# EAGLE schematic full_schema (EAGLE 9.6.2)
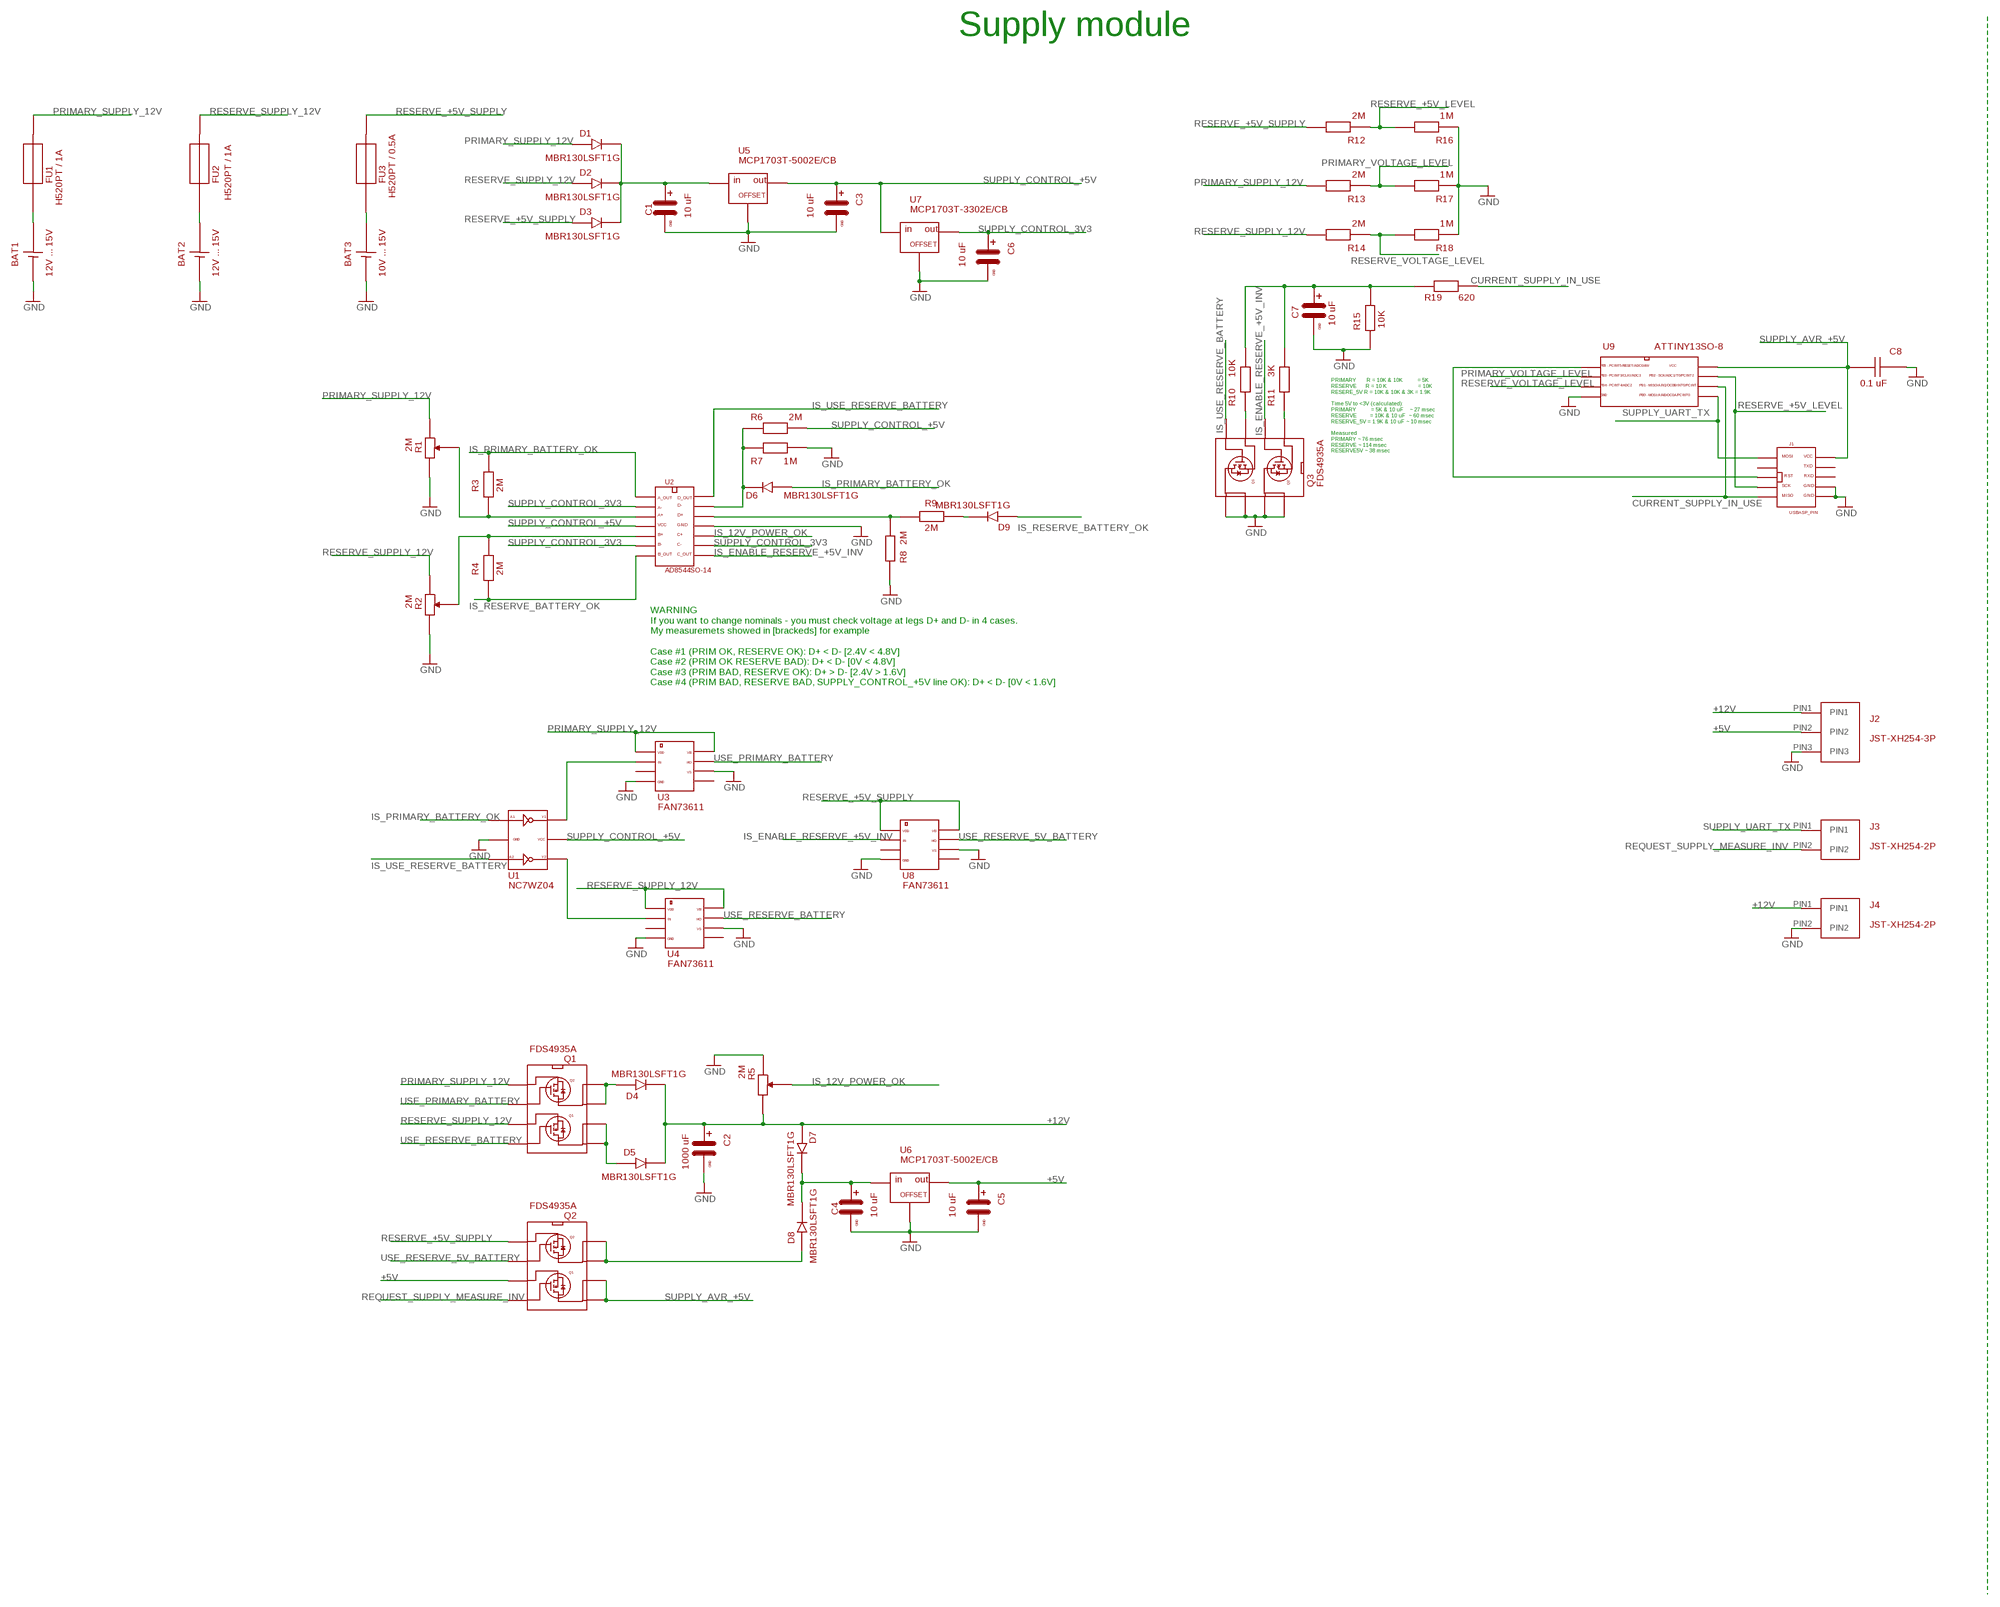
[diagram p0: schematic, sheet 1, part 1 of 2]
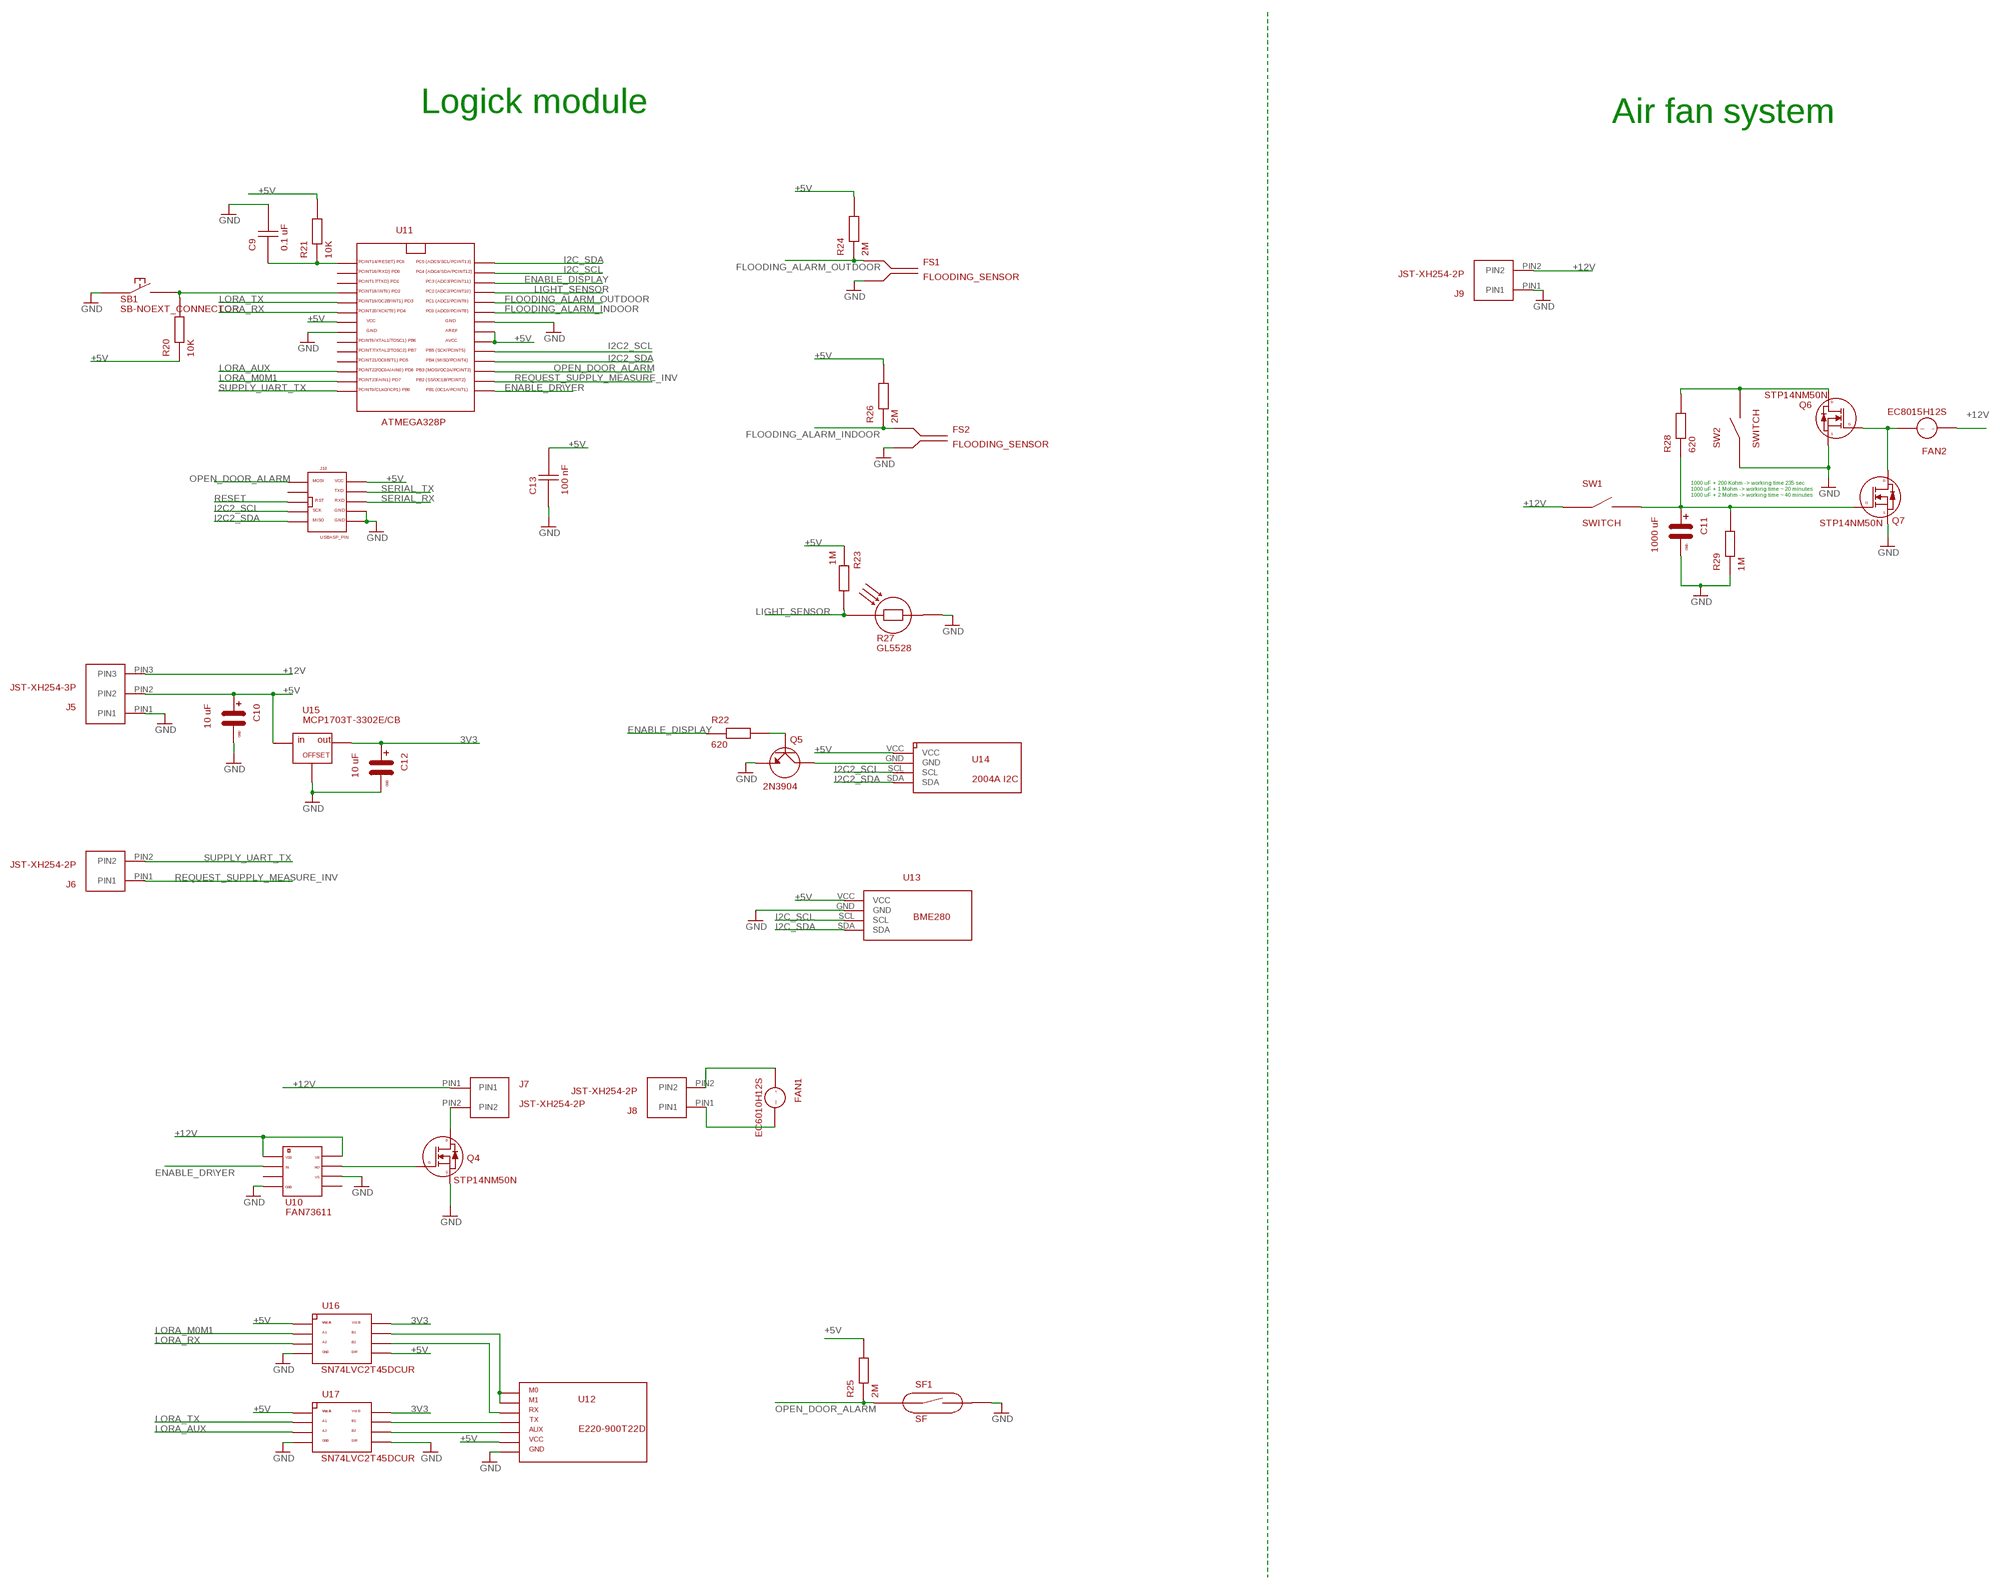
[diagram p1: schematic, sheet 1, part 2 of 2]

## Parts
BAT1  12V ... 15V  BATTERY  [BATTERY]
BAT2  12V ... 15V  BATTERY  [BATTERY]
BAT3  10V ... 15V  BATTERY  [BATTERY]
C1  10 uF  CMINI-5X7  [C-MINI-5X7]
C2  1000 uF  C  [C]
C3  10 uF  CMINI-5X7  [C-MINI-5X7]
C4  10 uF  CMINI-5X7  [C-MINI-5X7]
C5  10 uF  CMINI-5X7  [C-MINI-5X7]
C6  10 uF  CMINI-5X7  [C-MINI-5X7]
C7  10 uF  CMINI-5X7  [C-MINI-5X7]
C8  0.1 uF  C-1  [C-1]
C9  0.1 uF  C-1  [C-1]
C10  10 uF  CMINI-5X7  [C-MINI-5X7]
C11  1000 uF  C  [C]
C12  10 uF  CMINI-5X7  [C-MINI-5X7]
C13  100 nF  C-1  [C-1]
D1  MBR130LSFT1G  DSOD-123FL  [D-SOD-123FL]
D2  MBR130LSFT1G  DSOD-123FL  [D-SOD-123FL]
D3  MBR130LSFT1G  DSOD-123FL  [D-SOD-123FL]
D4  MBR130LSFT1G  DSOD-123FL  [D-SOD-123FL]
D5  MBR130LSFT1G  DSOD-123FL  [D-SOD-123FL]
D6  MBR130LSFT1G  DSOD-123FL  [D-SOD-123FL]
D7  MBR130LSFT1G  DSOD-123FL  [D-SOD-123FL]
D8  MBR130LSFT1G  DSOD-123FL  [D-SOD-123FL]
D9  MBR130LSFT1G  DSOD-123FL  [D-SOD-123FL]
FAN1  EC6010H12S  FAN_5V  [FAN_5V]
FAN2  EC8015H12S  FAN_5V  [FAN_5V]
FS1  FLOODING_SENSOR  [FLOODING_SENSOR]
FS2  FLOODING_SENSOR  [FLOODING_SENSOR]
FU1  H520PT / 1A  FU  [FU]
FU2  H520PT / 1A  FU  [FU]
FU3  H520PT / 0.5A  FU  [FU]
J1  USBASP_PIN  [USBASP_PIN]
J2  JST-XH254-3P  [JST-XH254-3P]
J3  JST-XH254-2P  [JST-XH254-2P]
J4  JST-XH254-2P  [JST-XH254-2P]
J5  JST-XH254-3P  [JST-XH254-3P]
J6  JST-XH254-2P  [JST-XH254-2P]
J7  JST-XH254-2P  [JST-XH254-2P]
J8  JST-XH254-2P  [JST-XH254-2P]
J9  JST-XH254-2P  [JST-XH254-2P]
J10  USBASP_PIN  [USBASP_PIN]
Q1  FDS4935A  MOSFET_P_X2  [SO-8]
Q2  FDS4935A  MOSFET_P_X2  [SO-8]
Q3  FDS4935A  MOSFET_P_X2  [SO-8]
Q4  STP14NM50N  MOSFET_N  [MOSFET_N]
Q5  2N3904  TRANSISTOR_NPN  [TRANSISTOR]
Q6  STP14NM50N  MOSFET_N  [MOSFET_N]
Q7  STP14NM50N  MOSFET_N  [MOSFET_N]
R1  2M  RD3296W-1-205LF  [RD-3296W-1-205LF]
R2  2M  RD3296W-1-205LF  [RD-3296W-1-205LF]
R3  2M  R  [R]
R4  2M  R  [R]
R5  2M  RD3296W-1-205LF  [RD-3296W-1-205LF]
R6  2M  R  [R]
R7  1M  R  [R]
R8  2M  R  [R]
R9  2M  R  [R]
R10  10K  R  [R]
R11  3K  R  [R]
R12  2M  R  [R]
R13  2M  R  [R]
R14  2M  R  [R]
R15  10K  R  [R]
R16  1M  R  [R]
R17  1M  R  [R]
R18  1M  R  [R]
R19  620  R  [R]
R20  10K  R  [R]
R21  10K  R  [R]
R22  620  R  [R]
R23  1M  R  [R]
R24  2M  R  [R]
R25  2M  R  [R]
R26  2M  R  [R]
R27  GL5528  RF  [RF]
R28  620  R  [R]
R29  1M  R  [R]
SB1  SB-NOEXT_CONNECTOR  [SB-EXT]
SF1  SF  [SF]
SW1  SWITCH  [SWITCH]
SW2  SWITCH  [SWITCH]
U1  NC7WZ04  INVERTER._X2  [SC70]
U2  AD8544SO-14  [SO-14]
U3  FAN73611  [SOIC-8]
U4  FAN73611  [SOIC-8]
U5  MCP1703T-5002E/CB  VOLTAGE_REGULATORSOT-23A  [SOT-23A]
U6  MCP1703T-5002E/CB  VOLTAGE_REGULATORSOT-23A  [SOT-23A]
U7  MCP1703T-3302E/CB  VOLTAGE_REGULATORSOT-23A  [SOT-23A]
U8  FAN73611  [SOIC-8]
U9  ATTINY13SO-8  [SO-8]
U10  FAN73611  [SOIC-8]
U11  ATMEGA328P  [ATMEGA328P]
U12  E220-900T22D  LORA  [LORA]
U13  BME280BME280-CONNECTOR-ONLY  [BME280-CONNECTOR-ONLY]
U14  2004A I2C  I2C_DISPLAY  [I2C_DISPLAY]
U15  MCP1703T-3302E/CB  VOLTAGE_REGULATORSOT-23A  [SOT-23A]
U16  SN74LVC2T45DCUR  LEVEL_CONVERTER_2L  [VSSOP-8]
U17  SN74LVC2T45DCUR  LEVEL_CONVERTER_2L  [VSSOP-8]

## Nets
3V3: C12.PLUS(PIN_PLUS) U15.P2(OUT) U16.P8(VCCB) U17.P8(VCCB)
+5V: C5.PLUS(PIN_PLUS) C10.PLUS(PIN_PLUS) C13.P$2 J2.PIN2 J5.PIN2 J10.VCC Q2.P3(S1) R20.P$1 R21.P$2 R23.P$1 R24.P$2 R25.P$2 R26.P$2 U6.P2(OUT) U11.AREF U11.AVCC U11.VCC U12.VCC U13.VCC U14.VCC U15.P3(IN) U16.P1(VCCA) U16.P5(DIR) U17.P1(VCCA)
+12V: C2.PIN_PLUS D4.CATHODE D5.CATHODE D7.ANODE FAN2.VCC J2.PIN1 J4.PIN1 J5.PIN3 J7.PIN1 J9.PIN2 R5.P2 SW1.P$1 U10.P_1(VDD) U10.P_8(VB)
CURRENT_SUPPLY_IN_USE: J1.MISO R19.P$2 U9.P6(PB1)
ENABLE_DISPLAY: R22.P$1 U11.PC3
ENABLE_DR\YER: U10.P_2(IN) U11.PB1
FLOODING_ALARM_INDOOR: FS2.P$1 R26.P$1 U11.PC0
FLOODING_ALARM_OUTDOOR: FS1.P$1 R24.P$1 U11.PC1
GND: C1.MINUS(PIN_GND) C2.PIN_GND C3.MINUS(PIN_GND) C4.MINUS(PIN_GND) C5.MINUS(PIN_GND) C6.MINUS(PIN_GND) C7.MINUS(PIN_GND) C8.P$2 C9.P$2 C10.MINUS(PIN_GND) C11.PIN_GND C12.MINUS(PIN_GND) C13.P$1 FS1.P$2 FS2.P$2 J1.GND J1.GND1 J2.PIN3 J4.PIN2 J5.PIN1 J9.PIN1 J10.GND J10.GND1 Q3.P5(D11) Q3.P6(D12) Q3.P7(D21) Q3.P8(D22) Q4.S Q5.E Q6.S Q7.S R1.P2 R2.P2 R5.P1 R7.P$1 R8.P$2 R15.P$1 R16.P$1 R17.P$1 R18.P$1 R27.PIN2 R29.P$1 SB1.P$1 SF1.P$2 SW2.P$1 U1.P2(GND) U2.P11(GND) U3.P_4(GND) U3.P_6(VS) U4.P_4(GND) U4.P_6(VS) U5.P1(GND) U6.P1(GND) U7.P1(GND) U8.P_4(GND) U8.P_6(VS) U9.P4(GND) U10.P_4(GND) U10.P_6(VS) U11.GND U11.GND1 U12.GND U13.GND U15.P1(GND) U16.P4(GND) U17.P4(GND) U17.P5(DIR)
I2C2_SCL: J10.SCK U11.PB5 U14.SCL
I2C2_SDA: J10.MISO U11.PB4 U14.SDA
I2C_SCL: U11.PC4 U13.SCL
I2C_SDA: U11.PC5 U13.SDA
IS_12V_POWER_OK: R5.P3 U2.P10(C+)
IS_ENABLE_RESERVE_+5V_INV: Q3.P2(G2) U2.P8(C_OUT) U8.P_2(IN)
IS_PRIMARY_BATTERY_OK: D6.ANODE R3.P$2 U1.P1(A1) U2.P1(A_OUT)
IS_RESERVE_BATTERY_OK: D9.ANODE R4.P$1 U2.P7(B_OUT)
IS_USE_RESERVE_BATTERY: Q3.P4(G1) U1.P3(A2) U2.P14(D_OUT)
LIGHT_SENSOR: R23.P$2 R27.PIN1 U11.PC2
LORA_AUX: U11.PD6 U17.P3(A2)
LORA_M0M1: U11.PD7 U16.P2(A1)
LORA_RX: U11.PD4 U16.P3(A2)
LORA_TX: U11.PD3 U17.P2(A1)
MINUS: BAT1.MINUS BAT2.MINUS BAT3.MINUS ; supply symbol labelled GND
N$1: C1.PLUS(PIN_PLUS) D1.CATHODE D2.CATHODE D3.CATHODE U5.P3(IN)
N$2: D6.CATHODE R6.P$2 R7.P$2 U2.P13(D-)
N$3: R1.P3 R3.P$1 U2.P3(A+)
N$4: J7.PIN2 Q4.D
N$5: C4.PLUS(PIN_PLUS) D7.CATHODE D8.CATHODE U6.P3(IN)
N$6: Q4.G U10.P_7(HO)
N$7: C9.P$1 R21.P$1 U11.PC6
N$8: R2.P3 R4.P$2 U2.P5(B+)
N$9: R8.P$1 R9.P$1 U2.P12(D+)
N$10: Q5.C U14.GND
N$11: Q5.B R22.P$2
N$12: D4.ANODE Q1.P7(D21) Q1.P8(D22)
N$13: D5.ANODE Q1.P5(D11) Q1.P6(D12)
N$14: FAN1.VCC J8.PIN2
N$15: FAN1.GND J8.PIN1
N$16: R20.P$2 SB1.P$2 U11.PD2
N$17: J1.RST(RESET) U9.P1(PB5)
N$18: U1.P6(Y1) U3.P_2(IN)
N$19: U1.P4(Y2) U4.P_2(IN)
N$22: FAN2.GND Q6.G Q7.D
N$23: C11.PIN_PLUS Q7.G R28.P$1 R29.P$2 SW1.P$2
N$24: Q6.D R28.P$2 SW2.P$2
N$25: Q3.P3(S1) R10.P$1
N$26: D8.ANODE Q2.P7(D21) Q2.P8(D22)
N$27: Q3.P1(S2) R11.P$1
N$28: D9.CATHODE R9.P$2
N$29: C7.PLUS(PIN_PLUS) R10.P$2 R11.P$2 R15.P$2 R19.P$1
N$30: U12.M0 U12.M1 U16.P7(B1)
N$31: U12.RX U16.P6(B2)
N$32: U12.TX U17.P7(B1)
N$33: U12.AUX U17.P6(B2)
OPEN_DOOR_ALARM: J10.MOSI R25.P$1 SF1.P$1 U11.PB3
PLUS: BAT1.PLUS BAT2.PLUS BAT3.PLUS FU1.P$1 FU2.P$1 FU3.P$1
PRIMARY_SUPPLY_12V: D1.ANODE FU1.P$2 Q1.P1(S2) R1.P1 R13.P$2 U3.P_1(VDD) U3.P_8(VB)
PRIMARY_VOLTAGE_LEVEL: R13.P$1 R17.P$2 U9.P2(PB3)
REQUEST_SUPPLY_MEASURE_INV: J3.PIN2 J6.PIN1 Q2.P4(G1) U11.PB2
RESERVE_+5V_LEVEL: J1.SCK R12.P$1 R16.P$2 U9.P7(PB2)
RESERVE_+5V_SUPPLY: D3.ANODE FU3.P$2 Q2.P1(S2) R12.P$2 U8.P_1(VDD) U8.P_8(VB)
RESERVE_SUPPLY_12V: D2.ANODE FU2.P$2 Q1.P3(S1) R2.P1 R14.P$2 U4.P_1(VDD) U4.P_8(VB)
RESERVE_VOLTAGE_LEVEL: R14.P$1 R18.P$2 U9.P3(PB4)
RESET: J10.RST(RESET)
SERIAL_RX: J10.RXD
SERIAL_TX: J10.TXD
SUPPLY_AVR_+5V: C8.P$1 J1.VCC Q2.P5(D11) Q2.P6(D12) U9.P8(VCC)
SUPPLY_CONTROL_3V3: C6.PLUS(PIN_PLUS) U2.P2(A-) U2.P6(B-) U2.P9(C-) U7.P2(OUT)
SUPPLY_CONTROL_+5V: C3.PLUS(PIN_PLUS) R6.P$1 U1.P5(VCC) U2.P4(VCC) U5.P2(OUT) U7.P3(IN)
SUPPLY_UART_TX: J1.MOSI J3.PIN1 J6.PIN2 U9.P5(PB0) U11.PB0
USE_PRIMARY_BATTERY: Q1.P2(G2) U3.P_7(HO)
USE_RESERVE_5V_BATTERY: Q2.P2(G2) U8.P_7(HO)
USE_RESERVE_BATTERY: Q1.P4(G1) U4.P_7(HO)
Unconnected: J1.NC1 J1.RXD J1.TXD J10.NC1 U3.P_3(NC1) U3.P_5(NC2) U4.P_3(NC1) U4.P_5(NC2) U8.P_3(NC1) U8.P_5(NC2) U10.P_3(NC1) U10.P_5(NC2) U11.PB6 U11.PB7 U11.PD0 U11.PD1 U11.PD5

## Notes on the sheet
- Supply module
- Logick module | Air fan system
- PRIMARY       R = 10K & 10K          = 5K
  RESERVE      R = 10 K                     = 10K
  RESERE_5V R = 10K & 10K & 3K = 1.9K
  
  Time 5V to <3V (calculated): 
  PRIMARY          = 5K & 10 uF    ~ 27 msec
  RESERVE         = 10K & 10 uF  ~ 60 msec
  RESERVE_5V = 1.9K & 10 uF ~ 10 msec
  
  Measured
  PRIMARY ~ 76 msec
  RESERVE ~ 114 msec
  RESERVE5V ~ 38 msec
- 1000 uF + 200 Kohm -> working time 235 sec
  1000 uF + 1 Mohm -> working time ~ 20 minutes
  1000 uF + 2 Mohm -> working time ~ 40 minutes
- WARNING
  If you want to change nominals - you must check voltage at legs D+ and D- in 4 cases.
  My measuremets showed in [brackeds] for example
  
  Case #1 (PRIM OK, RESERVE OK): D+ < D- [2.4V < 4.8V]
  Case #2 (PRIM OK RESERVE BAD): D+ < D- [0V < 4.8V]
  Case #3 (PRIM BAD, RESERVE OK): D+ > D- [2.4V > 1.6V]
  Case #4 (PRIM BAD, RESERVE BAD, SUPPLY_CONTROL_+5V line OK): D+ < D- [0V < 1.6V]

## Library data of the parts
BAT1-BAT3 = my_devices:BATTERY
C1-C7 C10-C12 = my_devices:C
C8 C9 C13 = my_devices:C-1
D1-D9 = my_devices:D
FAN1 FAN2 = my_devices:FAN_5V
FS1 FS2 = my_devices:FLOODING_SENSOR
FU1-FU3 = my_devices:FU
J1 J10 = my_devices:USBASP_PIN
J2 J5 = my_devices:JST-XH254-3P
J3 J4 J6-J9 = my_devices:JST-XH254-2P
Q1-Q3 = my_devices:MOSFET_P_X2
Q4 Q7 = my_devices:MOSFET_N
Q5 = my_devices:TRANSISTOR_NPN
Q6 = my_devices:MOSFET_N; SPICEPREFIX: Q
R1 R2 R5 = my_devices:RD
R3 R4 R6-R26 R28 R29 = my_devices:R
R27 = my_devices:RF
SB1 = my_devices:SB-NO
SF1 = my_devices:SF
SW1 SW2 = my_devices:SWITCH
U1 = my_devices:INVERTER._X2
U2 = my_devices:AD8544
U3 U4 U8 U10 = my_devices:FAN73611
U5-U7 U15 = my_devices:VOLTAGE_REGULATOR
U9 = my_devices:ATTINY13
U11 = my_devices:ATMEGA328P
U12 = my_devices:LORA
U13 = my_devices:BME280
U14 = my_devices:I2C_DISPLAY
U16 U17 = my_devices:LEVEL_CONVERTER_2L